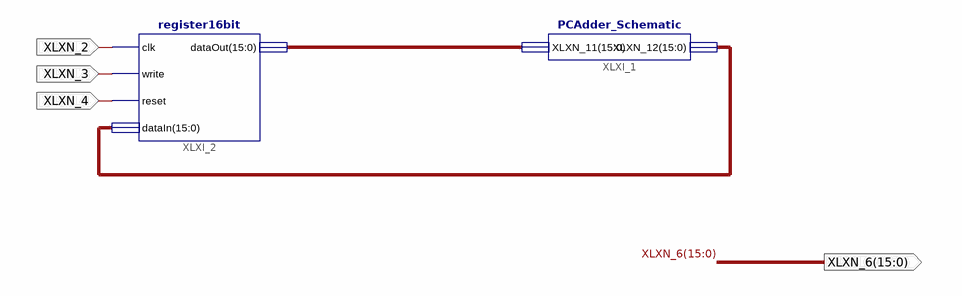
[diagram p0: schematic sheet 1]
// Xilinx ISE schematic PCPCAdder_Schematic.sch (spartan3e) as structural Verilog: 2 symbols, 4 ports
module PCPCAdder_Schematic (
  input  XLXN_2,
  input  XLXN_3,
  input  XLXN_4,
  output [15:0] XLXN_6
);

  wire [15:0] XLXN_1;

  PCAdder_Schematic XLXI_1 (.XLXN_11(XLXN_1), .XLXN_12(XLXN_6));
  register16bit XLXI_2 (.clk(XLXN_2), .write(XLXN_3), .reset(XLXN_4), .dataIn(XLXN_6), .dataOut(XLXN_1));
endmodule
